# Altium schematic sheet RF_and_GPS.SchDoc
size 420 x 297 mm
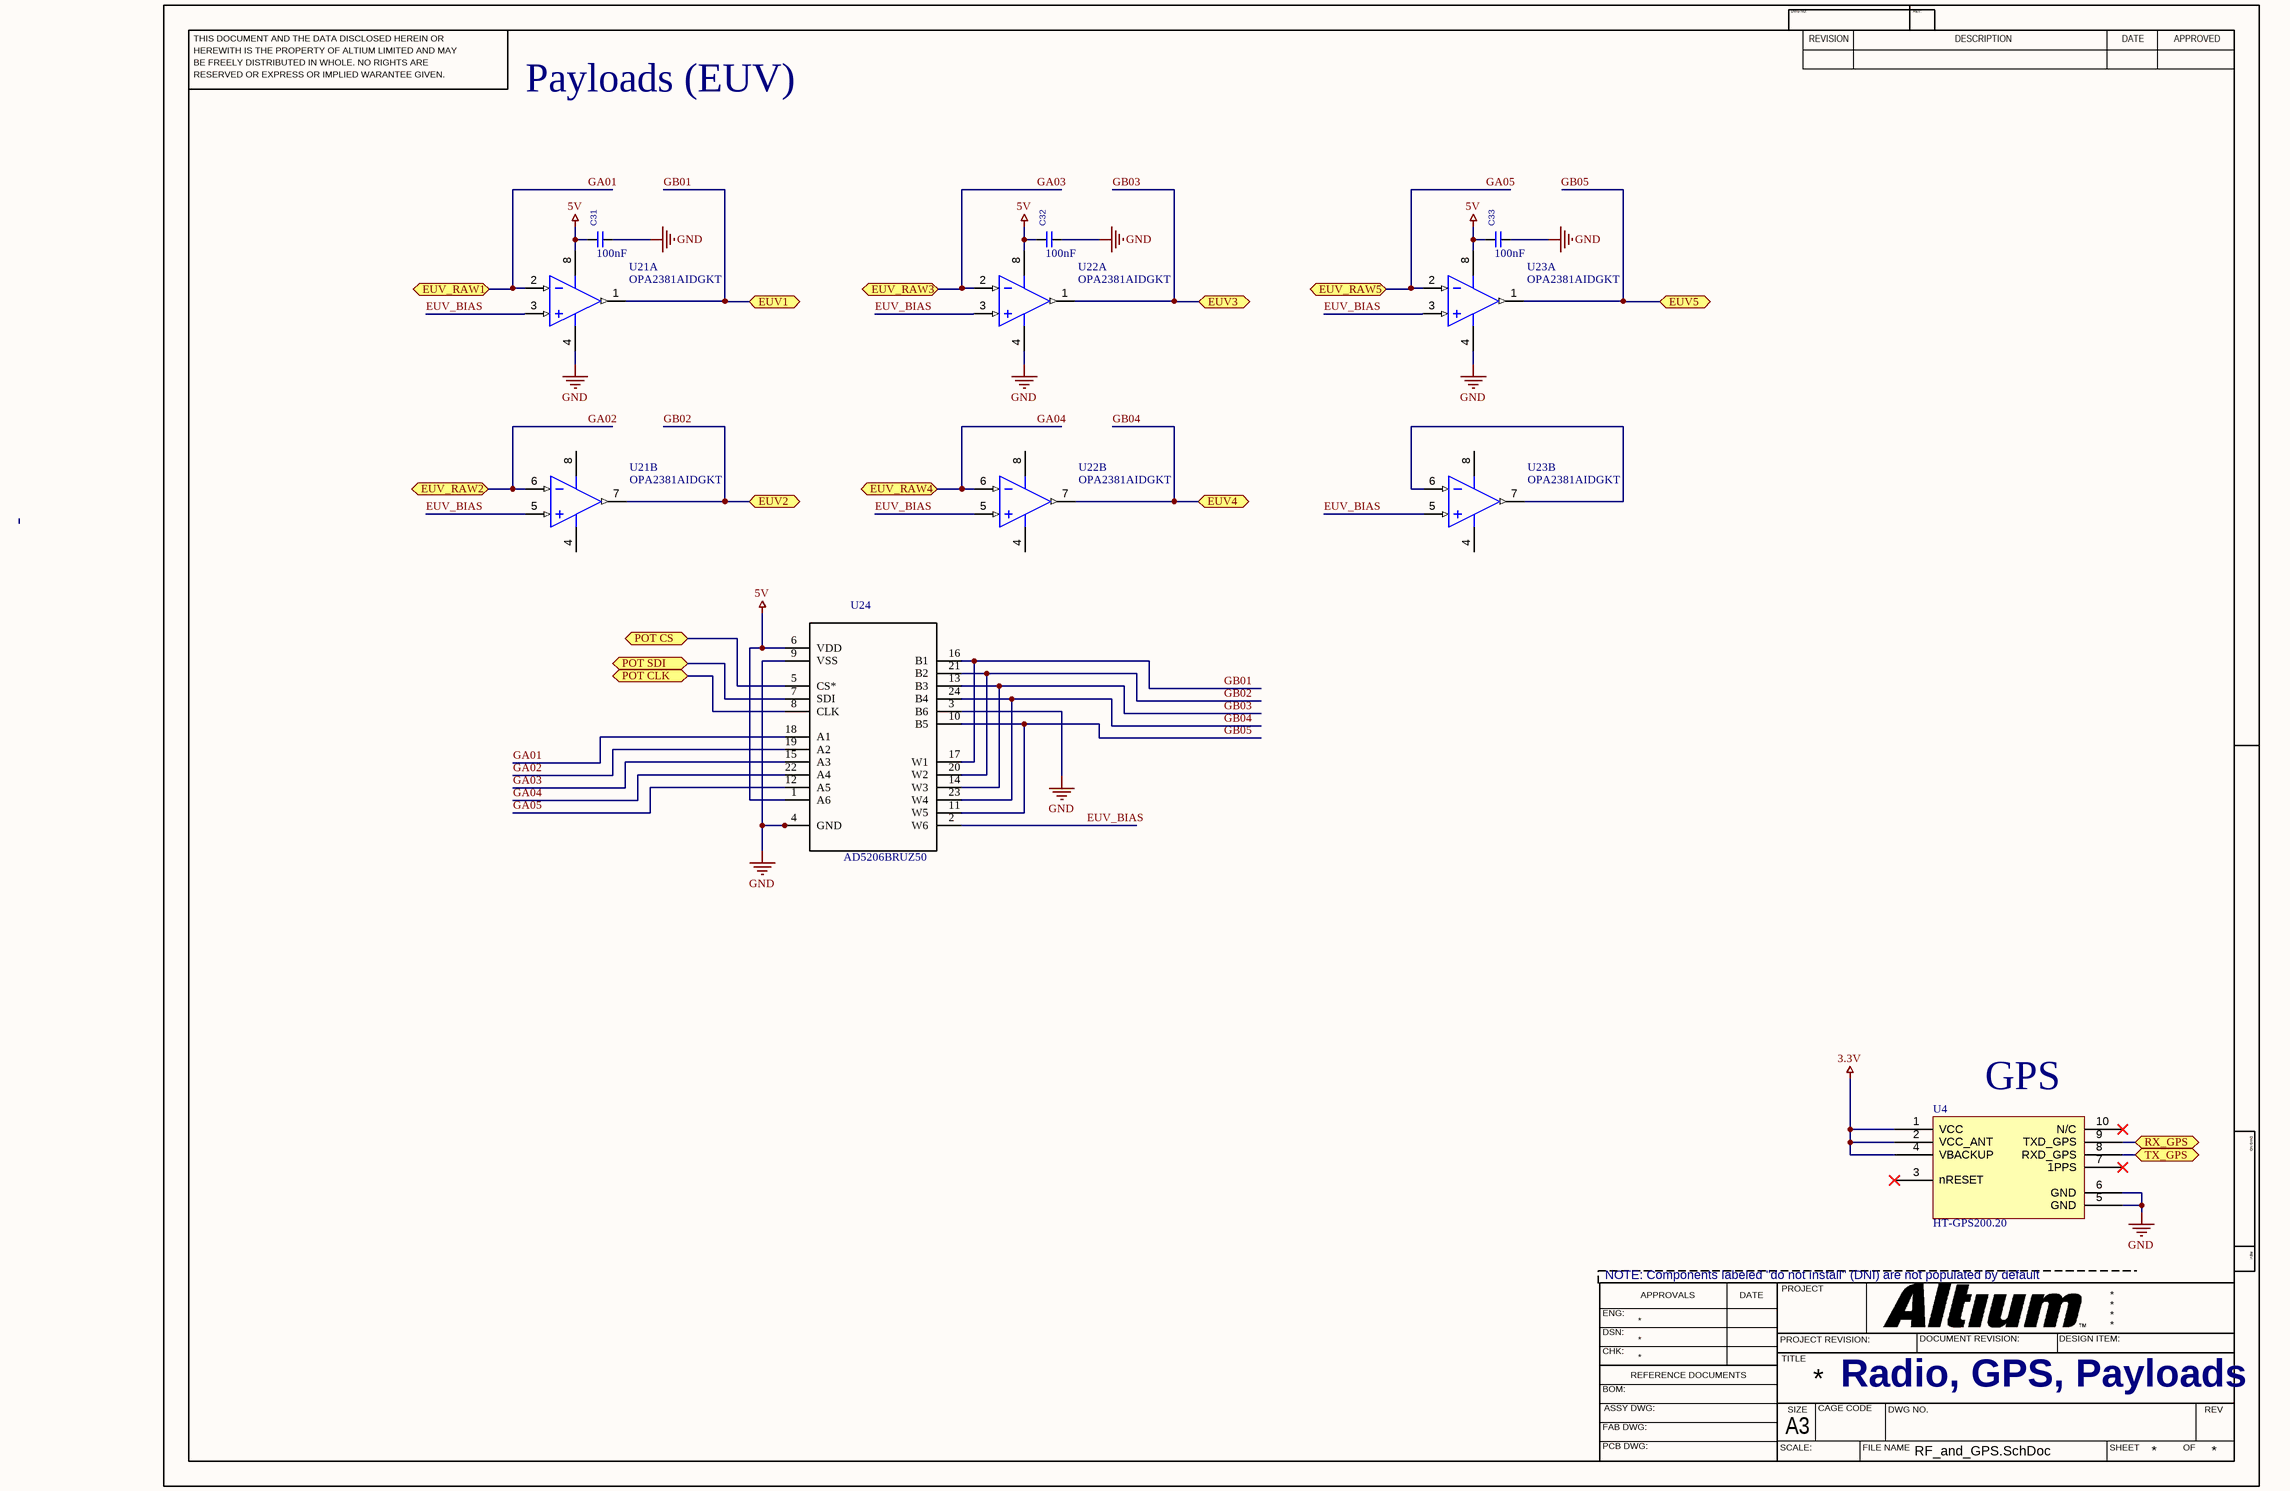
[diagram p0: RF_and_GPS.SchDoc]

## Parts
C31  100nF  [Resistor_0805]
C32  100nF  [Resistor_0805]
C33  100nF  [Resistor_0805]
U4  HT-GPS200.20  [HT-GPS200.20]
U21  OPA2381AIDGKT  [DGK0008A_N]  (parts A,B of 2)
U22  OPA2381AIDGKT  [DGK0008A_N]  (parts A,B of 2)
U23  OPA2381AIDGKT  [DGK0008A_N]  (parts A,B of 2)
U24  AD5206BRUZ50  [*SOP65P640X120-24N]

## Ports
EUV1 (bidir), EUV2 (bidir), EUV3 (bidir), EUV4 (bidir), EUV5 (bidir), EUV_RAW1 (bidir), EUV_RAW2 (bidir), EUV_RAW3 (bidir), EUV_RAW4 (bidir), EUV_RAW5 (bidir), POT CLK (bidir), POT CS (bidir), POT SDI (bidir), RX_GPS (bidir), TX_GPS (bidir)

## Nets
3.3V: U4.1(VCC) U4.2(VCC_ANT) U4.4(VBACKUP)
5V: C31.1 C32.1 C33.1 U21.8(V+) U22.8(V+) U23.8(V+) U24.1(A6) U24.6(VDD)
GND: C31.2 C32.2 C33.2 U4.5(GND) U4.6(GND) U21.4(V-) U22.4(V-) U23.4(V-) U24.3(B6) U24.4(GND) U24.9(VSS)
EUV5: U23.1(OUT_A) ; port EUV5
EUV_BIAS: U21.3(IN_A+) U21.5(IN_B+) U22.3(IN_A+) U22.5(IN_B+) U23.3(IN_A+) U23.5(IN_B+) U24.2(W6)
GA01: U21.2(IN_A-) U24.18(A1) ; port EUV_RAW1
GA02: U21.6(IN_B-) U24.19(A2) ; port EUV_RAW2
GA03: U22.2(IN_A-) U24.15(A3) ; port EUV_RAW3
GA04: U22.6(IN_B-) U24.22(A4) ; port EUV_RAW4
GA05: U23.2(IN_A-) U24.12(A5) ; port EUV_RAW5
GB01: U21.1(OUT_A) U24.16(B1) U24.17(W1) ; port EUV1
GB02: U21.7(OUT_B) U24.20(W2) U24.21(B2) ; port EUV2
GB03: U22.1(OUT_A) U24.13(B3) U24.14(W3) ; port EUV3
GB04: U22.7(OUT_B) U24.23(W4) U24.24(B4) ; port EUV4
GB05: U24.10(B5) U24.11(W5)
POT CLK: U24.8(CLK) ; port POT CLK
POT CS: U24.5(CS*) ; port POT CS
POT SDI: U24.7(SDI) ; port POT SDI
RX_GPS: U4.9(TXD_GPS) ; port RX_GPS
TX_GPS: U4.8(RXD_GPS) ; port TX_GPS
NetU23_6: U23.6(IN_B-) U23.7(OUT_B)

Not connected (* = marked no-connect by the designer): U4 3(nRESET)* 7(1PPS)* 10(N/C)*

## Notes on the sheet
- Payloads (EUV)
- (near U4) GPS
- NOTE: Components labeled "do not install" (DNI) are not populated by default
- Radio, GPS, Payloads
- Labels drawn without touching a wire or pin: GB05
- THIS DOCUMENT AND THE DATA DISCLOSED HEREIN OR
- HEREWITH IS THE PROPERTY OF ALTIUM LIMITED AND MAY
- DWG NO:
- REVISION
- REV:
- DESCRIPTION
- DATE
- APPROVED
- BE FREELY DISTRIBUTED IN WHOLE. NO RIGHTS ARE
- RESERVED OR EXPRESS OR IMPLIED WARANTEE GIVEN.
- ENG:
- APPROVALS
- PROJECT
- DSN:
- CHK:
- REFERENCE DOCUMENTS
- PROJECT REVISION:
- TITLE
- DOCUMENT REVISION:
- DESIGN ITEM:
- BOM:
- FAB DWG:
- PCB DWG:
- ASSY DWG:
- SCALE:
- A3
- SIZE
- CAGE CODE
- FILE NAME
- DWG NO.
- SHEET
- OF
- REV

## Library data of the parts
C31-C33 = CL21B104KBCNNNC: MPN: CL21B104KBCNNNC
U4 = HT-GPS200.20: HT-GPS200.20 GNSS module
U21-U23 = CMP-0272-01137-3: Precision, Low Power, Transimpedance Amplifier, 2.7 to 5 V, -40 to 125 degC, 8-pin SOP (DGK8), Green (RoHS & no Sb/Br); Manufacturer: Texas Instruments; Offset Drift(Typ)(uV/C): 0.03; Number of Channels: 2; Total Supply Voltage(Min)(+5V is 5, +/-5V is 10): 2.7; Slew Rate(Typ)(V/us): 12; CMRR(Min)(dB): 95; Sub Family: Low Offset Voltage Amplifier (<=500uV), Low Supply Voltage Amplifier (<=2.7V), Precision Amplifier; Iq per channel(Max)(mA): 1; Vio (25C)(Max)(mV): 0.025; IIB(Max)(pA): 50; Total Supply Voltage(Max)(+5V is 5, +/-5V is 10): 5; PackageVersion: 4073329/E, 05/2006; Code_JEDEC: MO-187; Mounting Technology: Surface Mount; PackageReference: DGK0008A; ComponentLink1URL: http://www.ti.com/; Eco-Plan: Green (RoHS & no Sb/Br); ComponentLink2URL: http://www.ti.com/general/docs/lit/getliterature.tsp?genericPartNumber=OPA2381&fileType=pdf; ComponentLink3URL: http://www.ti.com/litv/pdf/mpds028d; ComponentLink2Description: Datasheet; PackageDescription: 8-Pin Thin Small Outline, Body 3 x 3 mm, Pitch 0.65 mm; ComponentLink3Description: Package Specification; PartNumber: OPA2381AIDGKT; DatasheetVersion: SBOS313B; ComponentLink1Description: Manufacturer URL
U24 = AD5206BRUZ50: Check_prices: https://www.snapeda.com/parts/AD5206BRUZ50/Analog+Devices/view-part/?ref=eda; SnapEDA_Link: https://www.snapeda.com/parts/AD5206BRUZ50/Analog+Devices/view-part/?ref=snap; Value: *